# EAGLE design Rev1 (EAGLE 8.1.1)
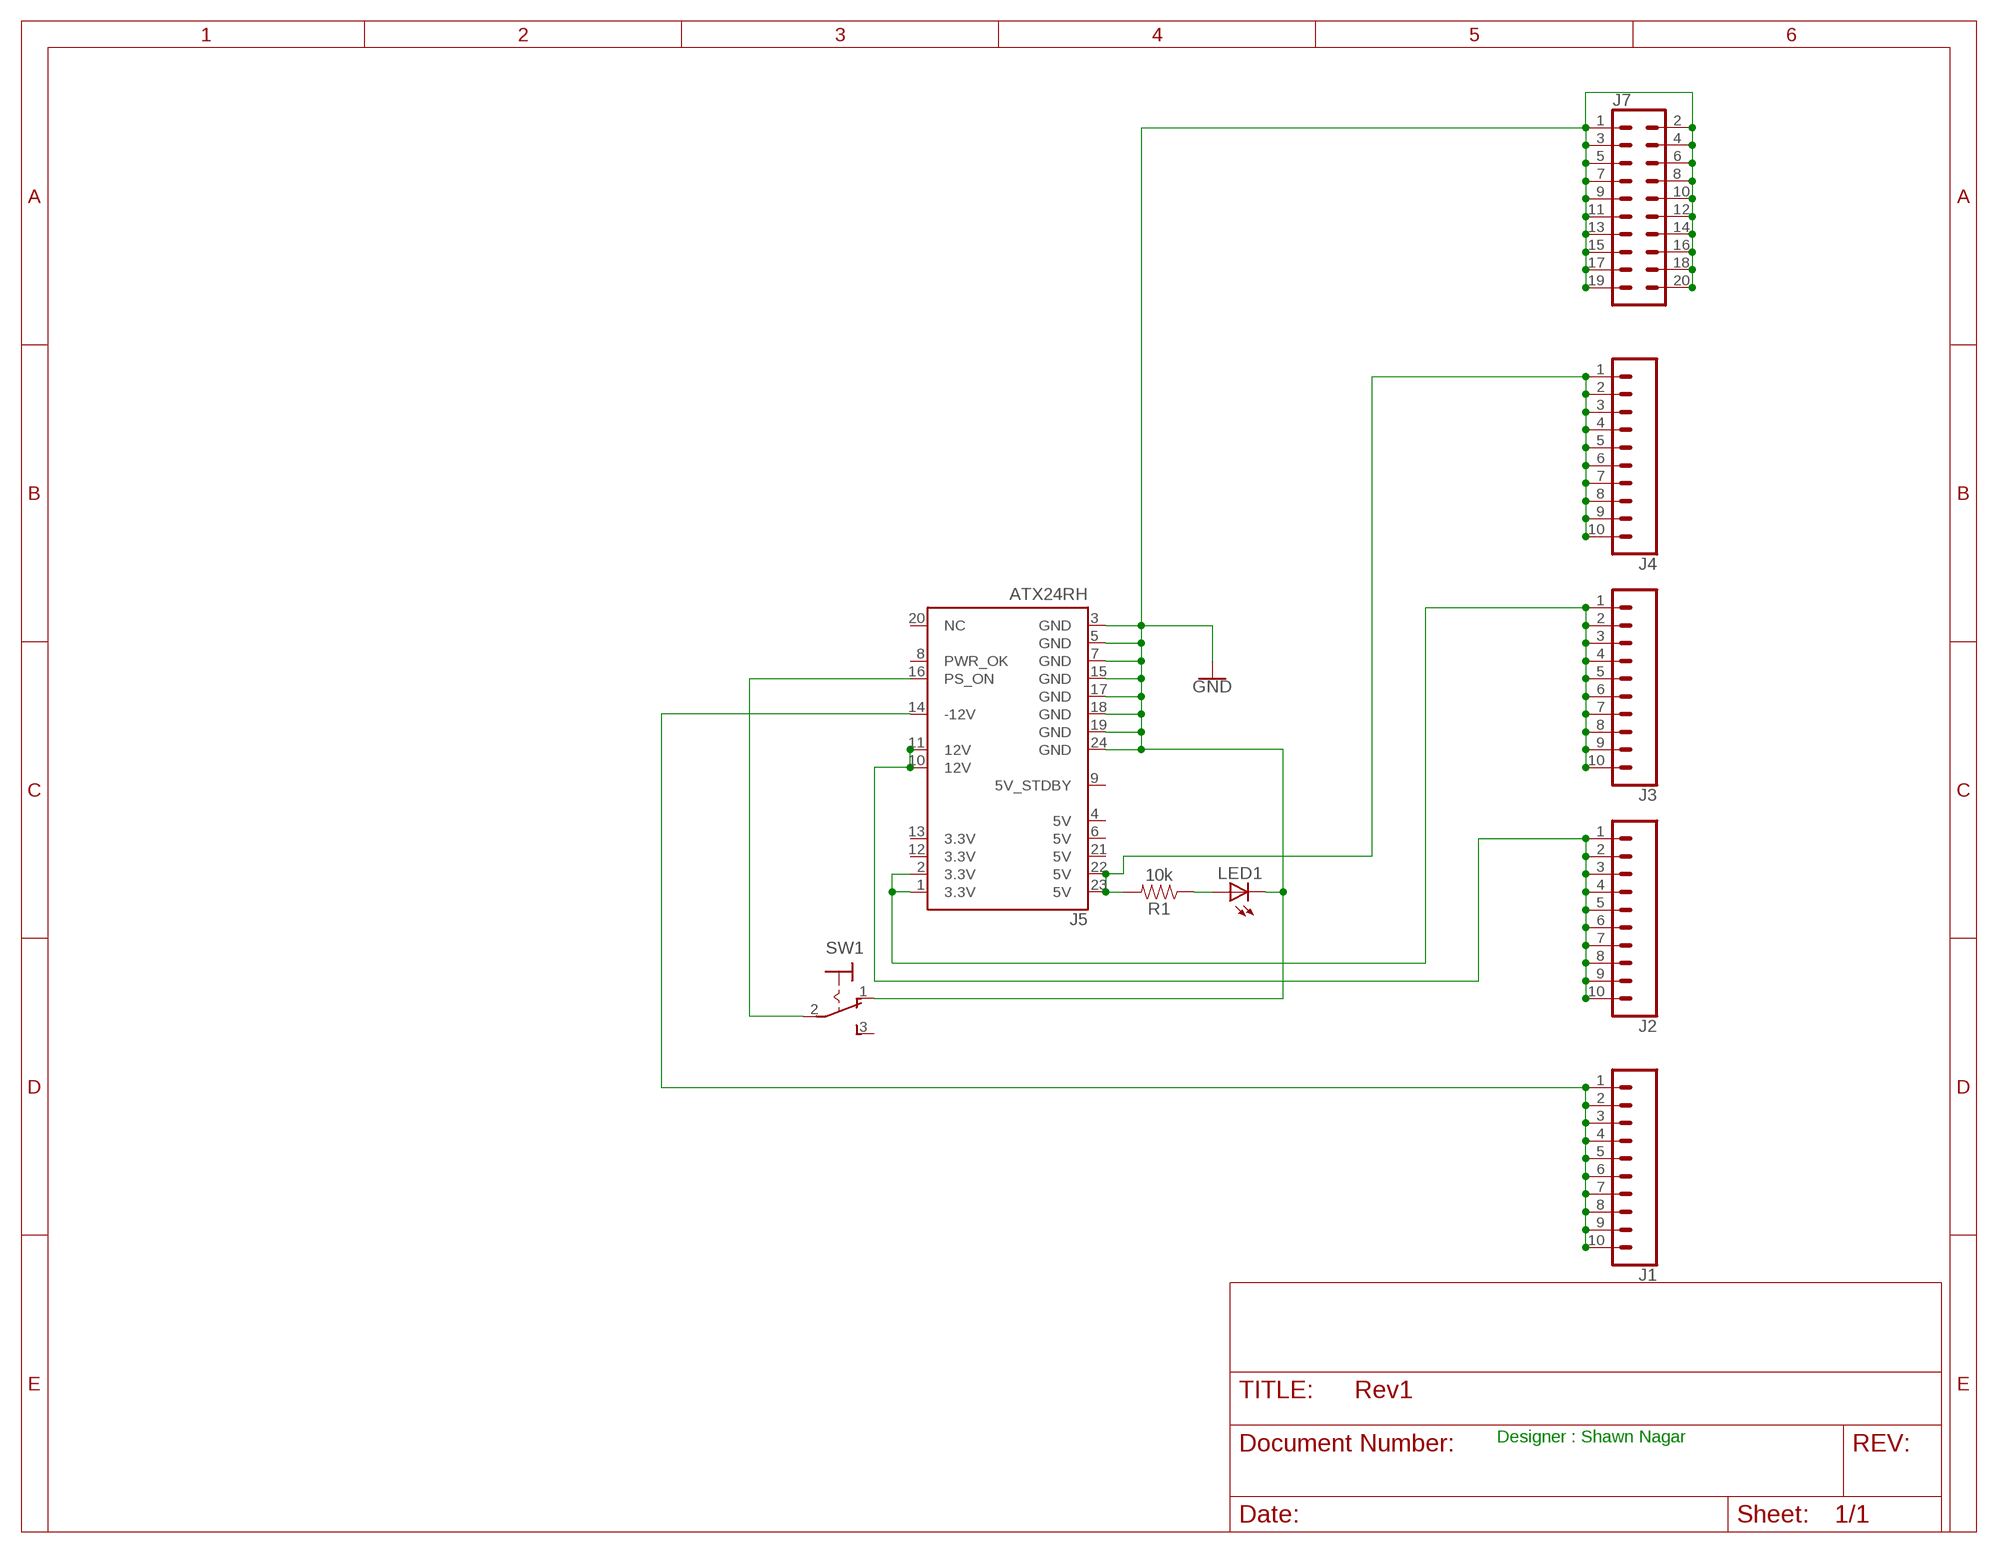
[diagram p0: schematic, sheet 1]

## Parts
J1  CONN_10"  [1X10]
J2  CONN_10"  [1X10]
J3  CONN_10"  [1X10]
J4  CONN_10"  [1X10]
J5  ATX24RH  [ATX24_RIGHT_ANGLE]
J7  CONN_10X2  [2X10]
LED1  LED5MM  [LED5MM]
R1  10k  10KOHM-HORIZ-1/4W-1%  [AXIAL-0.3]
SW1  320-916  [320-916]

## Nets
GND: J5.3(GND) J5.5(GND) J5.7(GND) J5.15(GND) J5.17(GND) J5.18(GND) J5.19(GND) J5.24(GND) J7.1 J7.2 J7.3 J7.4 J7.5 J7.6 J7.7 J7.8 J7.9 J7.10 J7.11 J7.12 J7.13 J7.14 J7.15 J7.16 J7.17 J7.18 J7.19 J7.20 LED1.K(C) SW1.1(O)
N$2: J5.16(PS_ON) SW1.2(P)
N$4: LED1.A R1.P$1
N$5: J4.1 J4.2 J4.3 J4.4 J4.5 J4.6 J4.7 J4.8 J4.9 J4.10 J5.22(5V) J5.23(5V) R1.P$2
N$6: J3.1 J3.2 J3.3 J3.4 J3.5 J3.6 J3.7 J3.8 J3.9 J3.10 J5.1(3.3V) J5.2(3.3V)
N$7: J2.1 J2.2 J2.3 J2.4 J2.5 J2.6 J2.7 J2.8 J2.9 J2.10 J5.10(12V) J5.11(12V)
N$9: J1.1 J1.2 J1.3 J1.4 J1.5 J1.6 J1.7 J1.8 J1.9 J1.10 J5.14(-12V)
Unconnected: J5.4(5V) J5.6(5V) J5.8(PWR_OK) J5.9(5V_STDBY) J5.12(3.3V) J5.13(3.3V) J5.20(NC) J5.21(5V) SW1.3(S)

## Notes on the sheet
- Designer : Shawn Nagar

## Library data of the parts
J1-J4 = SparkFun-Connectors:CONN_10: Multi connection point. Often used as Generic Header-pin footprint for 0.1 inch spaced/style header connections On any of the 0.1 inch spaced packages, you can populate with these: Break Away Headers - Straight <https://www.sparkfun.com/products/116> (PRT-00116) Break Away Male Headers - Right Angle <https://www.sparkfun.com/products/553> (PRT-00553) Female Headers <https://www.sparkfun.com/products/115> (PRT-00115) Break Away Headers - Machine Pin <https://www.sparkfun.com/products/117> (PRT-00117) Break Away Female Headers - Swiss Machine Pin <https://www.sparkfun.com/products/743> (PRT-00743) Arduino Stackable Header - 10 Pin <https://www.sparkfun.com/products/11376> (PRT-11376) For SCREWTERMINALS and SPRING TERMINALS visit here: Screw Terimnals on SparkFun.com <https://www.sparkfun.com/search/results?term=Screw+Terminals> (5mm/3.5mm/2.54mm spacing) This device is also useful as a general connection point to wire up your design to another part of your project. Our various solder wires solder well into these plated through hole pads. Hook-Up Wire - Assortment (Stranded, 22 AWG) <https://www.sparkfun.com/products/11375> (PRT-11375) Hook-Up Wire - Assortment (Solid Core, 22 AWG) <https://www.sparkfun.com/products/11367> (PRT-11367) View the entire wire category on our website here <https://www.sparkfun.com/categories/141> Special notes: Molex polarized connector foot print use with SKU : PRT-08231 with associated crimp pins and housings. 1MM SMD Version SKU: PRT-10208 NOTES ON THE VARIANTS LOCK and LOCK_LONGPADS... This footprint was designed to help hold the alignment of a through-hole component (i.e. 6-pin header) while soldering it into place. You may notice that each hole has been shifted either up or down by 0.005 of an inch from it's more standard position (which is a perfectly straight line). This slight alteration caused the pins (the squares in the middle) to touch the edges of the holes. Because they are alternating, it causes a "brace" to hold the component in place. 0.005 has proven to be the perfect amount of "off-center" position when using our standard breakaway headers. Although looks a little odd when you look at the bare footprint, once you have a header in there, the alteration is very hard to notice. Also,if you push a header all the way into place, it is covered up entirely on the bottom side.; PROD_ID: CONN-11563
J5 = SparkFun-Connectors:ATX24: ATX24 Pin Power Supply Connector - Right Angle PTH Mount This is a good connector for connecting a computer power supply to a PCB. It's massive, but provides many amps of power at 5V and 12V. SparkFun Products: SparkFun Benchtop Power Board Kit <https://www.sparkfun.com/products/12867> SparkFun Power Driver Shield Kit <https://www.sparkfun.com/products/10618>; PROD_ID: CONN-09674; SF_ID: PRT-09498
J7 = SparkFun-Connectors:CONN_10X2: Multi connection point. Often used as Generic Header-pin footprint for 0.1 inch spaced/style header connections On any of the 0.1 inch spaced packages, you can populate with these: Break Away Headers - Straight <https://www.sparkfun.com/products/116> (PRT-00116) Break Away Male Headers - Right Angle <https://www.sparkfun.com/products/553> (PRT-00553) Female Headers <https://www.sparkfun.com/products/115> (PRT-00115) Break Away Headers - Machine Pin <https://www.sparkfun.com/products/117> (PRT-00117) Break Away Female Headers - Swiss Machine Pin <https://www.sparkfun.com/products/743> (PRT-00743) Special note about the "SPECIAL" package: This was SPECIALLY designed to be used with our Graphic LCD Backpack. Be sure you want to use this! It is not only staggered on each line of header holes, but IT IS ALSO offset of the center point of the top and bottom lines by 5 mil. This causes the headers to lock into place on the "standard" footprint on the LCD screen. The extra squares on the tdocu layer are there simply to reference other pins (if you were to actually populate a longer header than ten long - this is what we do with the backpacks).
LED1 = led:LED: LED OSRAM: - CHIPLED LG R971, LG N971, LY N971, LG Q971, LY Q971, LO R971, LY R971 LH N974, LH R974 LS Q976, LO Q976, LY Q976 LO Q996 - Hyper CHIPLED LW Q18S LB Q993, LB Q99A, LB R99A - SideLED LS A670, LO A670, LY A670, LG A670, LP A670 LB A673, LV A673, LT A673, LW A673 LH A674 LY A675 LS A676, LA A676, LO A676, LY A676, LW A676 LS A679, LY A679, LG A679 - Hyper Micro SIDELED® LS Y876, LA Y876, LO Y876, LY Y876 LT Y87S - SmartLED LW L88C, LW L88S LB L89C, LB L89S, LG L890 LS L89K, LO L89K, LY L89K LS L896, LA L896, LO L896, LY L896 - TOPLED LS T670, LO T670, LY T670, LG T670, LP T670 LSG T670, LSP T670, LSY T670, LOP T670, LYG T670 LG T671, LOG T671, LSG T671 LB T673, LV T673, LT T673, LW T673 LH T674 LS T676, LA T676, LO T676, LY T676, LB T676, LH T676, LSB T676, LW T676 LB T67C, LV T67C, LT T67C, LS T67K, LO T67K, LY T67K, LW E67C LS E67B, LA E67B, LO E67B, LY E67B, LB E67C, LV E67C, LT E67C LW T67C LS T679, LY T679, LG T679 LS T770, LO T770, LY T770, LG T770, LP T770 LB T773, LV T773, LT T773, LW T773 LH T774 LS E675, LA E675, LY E675, LS T675 LS T776, LA T776, LO T776, LY T776, LB T776 LHGB T686 LT T68C, LB T68C - Hyper Mini TOPLED® LB M676 - Mini TOPLED Santana® LG M470 LS M47K, LO M47K, LY M47K Source: http://www.osram.convergy.de LUXEON: - LUMILED® LXK2-PW12-R00, LXK2-PW12-S00, LXK2-PW14-U00, LXK2-PW14-V00 LXK2-PM12-R00, LXK2-PM12-S00, LXK2-PM14-U00 LXK2-PE12-Q00, LXK2-PE12-R00, LXK2-PE12-S00, LXK2-PE14-T00, LXK2-PE14-U00 LXK2-PB12-K00, LXK2-PB12-L00, LXK2-PB12-M00, LXK2-PB14-N00, LXK2-PB14-P00, LXK2-PB14-Q00 LXK2-PR12-L00, LXK2-PR12-M00, LXK2-PR14-Q00, LXK2-PR14-R00 LXK2-PD12-Q00, LXK2-PD12-R00, LXK2-PD12-S00 LXK2-PH12-R00, LXK2-PH12-S00 LXK2-PL12-P00, LXK2-PL12-Q00, LXK2-PL12-R00 Source: www.luxeon.com KINGBRIGHT: KA-3528ASYC Source: www.kingbright.com
R1 = SparkFun-Resistors:10KOHM: 10kΩ resistor A resistor is a passive two-terminal electrical component that implements electrical resistance as a circuit element. Resistors act to reduce current flow, and, at the same time, act to lower voltage levels within circuits. - Wikipedia; PROD_ID: RES-12183
SW1 = switch:320-916: TOGGLE SWITCH distributor RS Components

## Board
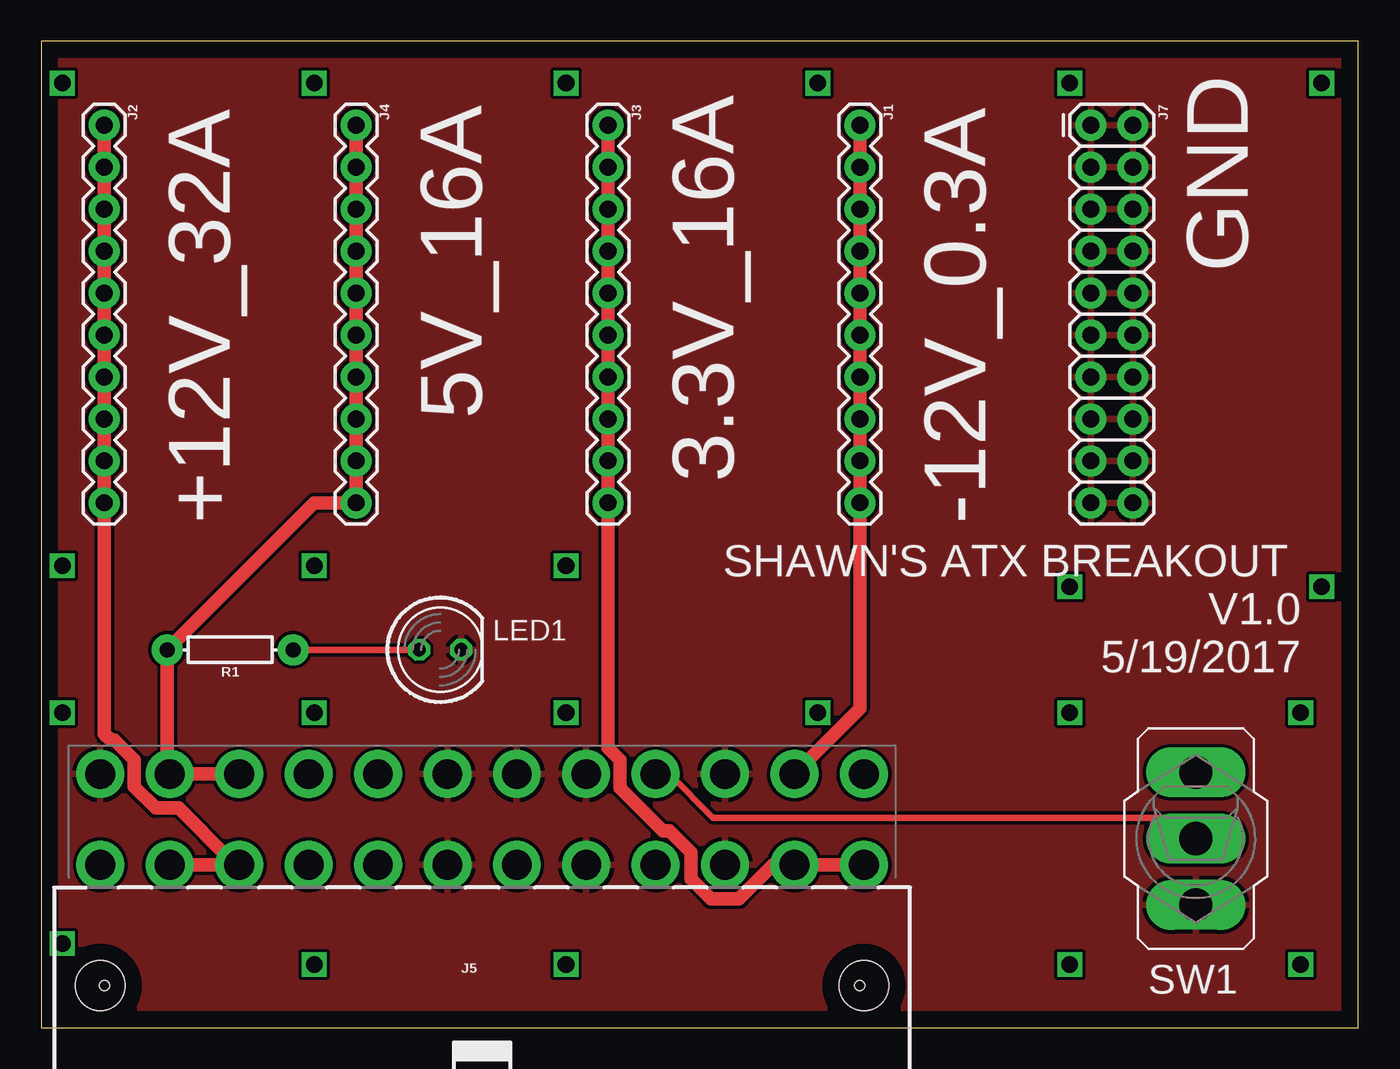
[diagram p1: board, top side]
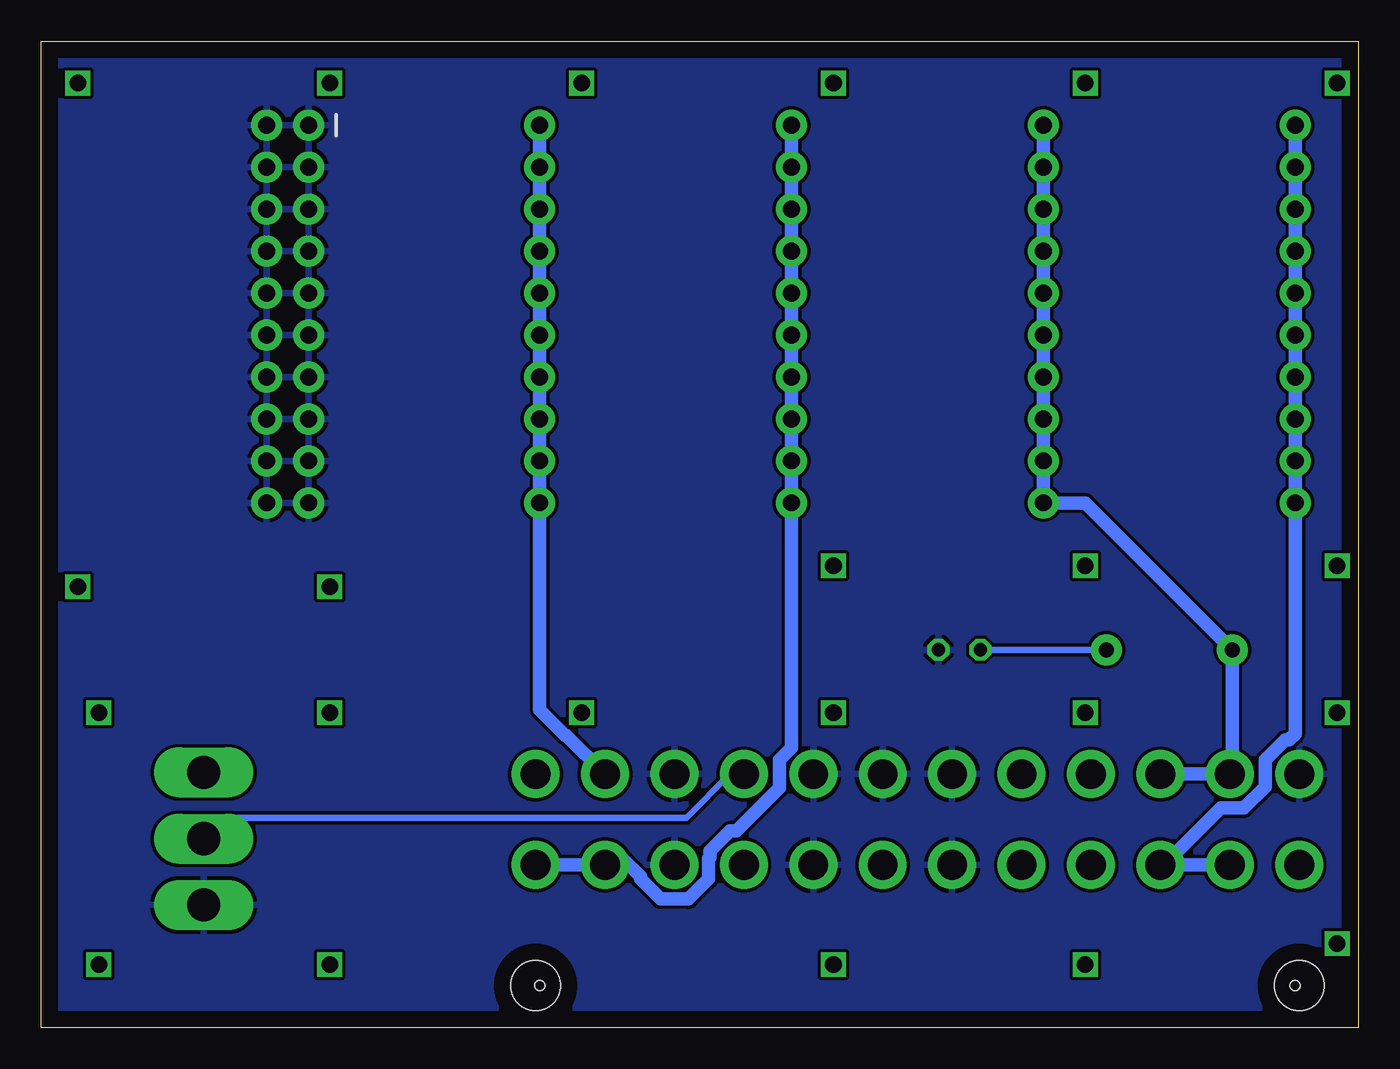
[diagram p2: board, bottom side, seen from below]

Size 79.68 x 59.68 mm. Coordinates in mm from the lower left corner, seen from the top.
Outline: 0,0 79.68,0 79.68,59.68 0,59.68 0,0
Copper layers (1*16): Top 0.035mm / dielectric 1.5mm / Bottom 0.035mm
Design rules "default": minimum track width 10mil, minimum drill 24mil, track to track 8mil, track to pad 8mil, pad to pad 8mil, via to via 8mil, smd to smd 8mil, copper to edge 40mil, drill to drill 8mil, minimum pad ring 10mil, minimum via ring 8mil, stop-mask expansion 4mil, vias tented up to drill 0mil, thermal gap 10mil
Holes 0.6 mm at 3.81,2.54 49.53,2.54

### Footprints (pad centres in the part's own frame; a part is rotated, then mirrored left to right if it is on the bottom)
1X10 = drill 1.016 pad 1.88: 1 0,0; 2 2.54,0; 3 5.08,0; 4 7.62,0; 5 10.16,0; 6 12.7,0; 7 15.24,0; 8 17.78,0; 9 20.32,0; 10 22.86,0
ATX24_RIGHT_ANGLE = drill 1.8 pad 2.9: 1 23.1,4.76; 2 18.9,4.76; 3 14.7,4.76; 4 10.5,4.76; 5 6.3,4.76; 6 2.1,4.76; 7 -2.1,4.76; 8 -6.3,4.76; 9 -10.5,4.76; 10 -14.7,4.76; 11 -18.9,4.76; 12 -23.1,4.76; 13 23.1,10.26; 14 18.9,10.26; 15 14.7,10.26; 16 10.5,10.26; 17 6.3,10.26; 18 2.1,10.26; 19 -2.1,10.26; 20 -6.3,10.26; 21 -10.5,10.26; 22 -14.7,10.26; 23 -18.9,10.26; 24 -23.1,10.26 | hole 3: -23.1,-2.54; 23.1,-2.54
2X10 = drill 1.016 pad 1.88: 1 0,0; 2 0,2.54; 3 2.54,0; 4 2.54,2.54; 5 5.08,0; 6 5.08,2.54; 7 7.62,0; 8 7.62,2.54; 9 10.16,0; 10 10.16,2.54; 11 12.7,0; 12 12.7,2.54; 13 15.24,0; 14 15.24,2.54; 15 17.78,0; 16 17.78,2.54; 17 20.32,0; 18 20.32,2.54; 19 22.86,0; 20 22.86,2.54
LED5MM = drill 0.813 octagon: A -1.27,0; K 1.27,0
AXIAL-0.3 = drill 0.9 pad 1.88: P$1 -3.81,0; P$2 3.81,0
320-916 = drill 2.007 long: 1 0,4.013; 2 0,0; 3 0,-4.013

### Placement (x,y rotation side)
J1  49.53,54.61 270 top
J2  3.81,54.61 270 top
J3  34.29,54.61 270 top
J4  19.05,54.61 270 top
J5  26.67,5.08 0 top
J7  63.5,54.61 270 top
LED1  24.13,22.86 0 top
R1  11.43,22.86 180 top
SW1  69.85,11.43 180 top

### Tracks (layer width: path | path; a pad name or v marks a point on that pad's centre or on a via)
GND
  pour Bottom: 0,59.69 0,0 80.01,0 80.01,59.69
  pour Top: 0,59.69 0,0 80.01,0 80.01,59.69 1.27,59.69
N$2
  Top 0.406: J5.16 38,15.34 40.64,12.7 68.58,12.7 SW1.2
  Bottom 0.406: J5.16 38,15.34 40.64,12.7 68.58,12.7 SW1.2
N$4
  Top 0.406: R1.P$1 LED1.A
  Bottom 0.406: R1.P$1 LED1.A
N$5
  Top 0.406: J5.23 7.62,15.34
  Top 0.813: J4.1 J4.2 J4.3 J4.4 J4.5 J4.6 J4.7 J4.8 J4.9 J4.10 16.51,31.75 R1.P$2 7.62,15.49 J5.23 J5.22
  Bottom 0.813: J4.1 J4.2 J4.3 J4.4 J4.5 J4.6 J4.7 J4.8 J4.9 J4.10 16.51,31.75 R1.P$2 7.62,15.49 J5.23 J5.22
N$6
  Top 0.406: 34.29,30.82 J3.10
  Top 0.813: J3.1 J3.2 J3.3 J3.4 J3.5 J3.6 J3.7 J3.8 J3.9 J3.10 34.29,16.93 35.03,16.19 35.03,14.5 37.63,11.9 38.02,11.9 39.31,10.61 39.31,8.99 40.52,7.78 42.22,7.78 44.28,9.84 J5.2 J5.1
  Bottom 0.813: J3.1 J3.2 J3.3 J3.4 J3.5 J3.6 J3.7 J3.8 J3.9 J3.10 34.29,16.93 35.03,16.19 35.03,14.5 37.63,11.9 38.02,11.9 39.23,10.69 39.23,10.3 39.31,10.22 39.31,8.99 40.52,7.78 42.22,7.78 43.43,8.99 43.43,9.14 44.45,10.16 45.25,10.16 J5.2 J5.1
N$7
  Top 0.813: J5.10 11.75,9.84 11.43,10.16 | 11.43,10.16 8.31,13.28 6.92,13.28 5.63,14.57 5.63,16.19 4.42,17.4 4.19,17.4 3.81,17.78 J2.10 J2.9 J2.8 J2.7 J2.6 J2.5 J2.4 J2.3 J2.2 J2.1 | J5.11 11.11,9.84 11.43,10.16
  Bottom 0.813: 11.43,9.84 J5.11 11.43,9.84 | 11.43,9.84 J5.10 11.75,9.84 8.31,13.28 6.92,13.28 5.63,14.57 5.63,16.19 4.42,17.4 4.19,17.4 3.81,17.78 J2.10 J2.9 J2.8 J2.7 J2.6 J2.5 J2.4 J2.3 J2.2 J2.1
N$8  (via drill 1 pad 1.02)
  other vias: 1.27,19.05
N$9  (via drill 0.6)
  Top 0.406: J5.14 45.72,15.49
  Top 0.813: J1.1 J1.2 J1.3 J1.4 J1.5 J1.6 J1.7 J1.8 J1.9 J1.10 49.53,19.3 J5.14
  Bottom 0.813: J1.1 J1.2 J1.3 J1.4 J1.5 J1.6 J1.7 J1.8 J1.9 J1.10 49.53,19.23 47.99,17.69 47.92,17.69 J5.14
  other vias: 49.53,54.61
N$10  (via drill 1 pad 1.02)
  other vias: 16.51,19.05
N$11  (via drill 1 pad 1.02)
  other vias: 31.75,19.05
N$12  (via drill 1 pad 1.02)
  other vias: 46.99,19.05
N$13  (via drill 1 pad 1.02)
  other vias: 62.23,19.05
N$14  (via drill 1 pad 1.02)
  other vias: 76.2,19.05
N$15  (via drill 1 pad 1.02)
  other vias: 1.27,5.08
N$16  (via drill 1 pad 1.02)
  other vias: 16.51,3.81
N$17  (via drill 1 pad 1.02)
  other vias: 31.75,3.81
N$18  (via drill 1 pad 1.02)
  other vias: 62.23,3.81
N$19  (via drill 1 pad 1.02)
  other vias: 76.2,3.81
N$20  (via drill 1 pad 1.02)
  other vias: 1.27,57.15
N$21  (via drill 1 pad 1.02)
  other vias: 16.51,57.15
N$22  (via drill 1 pad 1.02)
  other vias: 31.75,57.15
N$23  (via drill 1 pad 1.02)
  other vias: 46.99,57.15
N$24  (via drill 1 pad 1.02)
  other vias: 62.23,57.15
N$25  (via drill 1 pad 1.02)
  other vias: 77.47,57.15
N$26  (via drill 1 pad 1.02)
  other vias: 1.27,27.94
N$27  (via drill 1 pad 1.02)
  other vias: 16.51,27.94
N$28  (via drill 1 pad 1.02)
  other vias: 31.75,27.94
N$29  (via drill 1 pad 1.02)
  other vias: 62.23,26.67
N$30  (via drill 1 pad 1.02)
  other vias: 77.47,26.67

### Text on the board
tPlace: GND | 5V_16A | 3.3V_16A | +12V_32A | -12V_0.3A | SHAWN'S ATX BREAKOUT / V1.0 / 5/19/2017